# Altium project STM8_DevBoard.PrjPCB
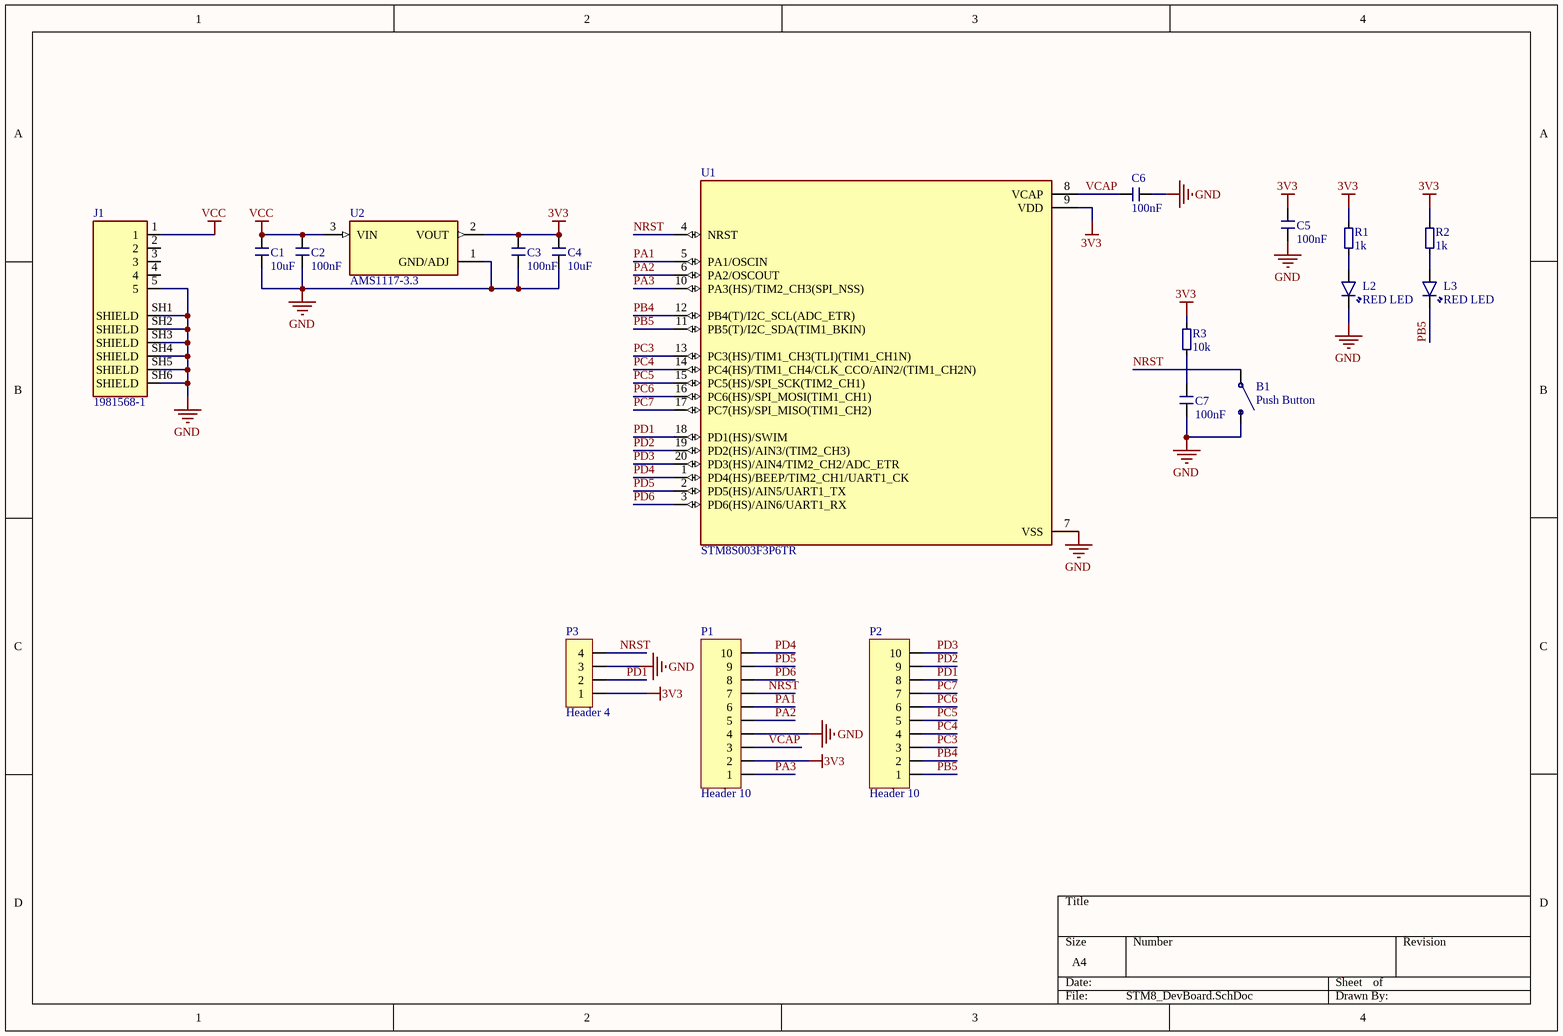
[diagram p0: STM8_DevBoard.SchDoc]
1 sheet, 19 parts. Net scope: global (net labels, ports and power ports of the same name join across sheets).
Board file: STM8_DevBoard.PcbDoc

## Sheet STM8_DevBoard.SchDoc
size A4

### Parts
B1  Push Button  [NRST]
C1  10uF  [1206_Capacitor]
C2  100nF  [1206_Capacitor]
C3  100nF  [1206_Capacitor]
C4  10uF  [1206_Capacitor]
C5  100nF  [1206_Capacitor]
C6  100nF  [1206_Capacitor]
C7  100nF  [1206_Capacitor]
J1  1981568-1  [TE_1981568-1]
L2  RED LED  [0805_LED]
L3  RED LED  [0805_LED]
P1  Header 10  [Header 10]
P2  Header 10  [Header 10]
P3  Header 4  [Header 4]
R1  1k  [1206 Resistor]
R2  1k  [1206 Resistor]
R3  10k  [1206 Resistor]
U1  STM8S003F3P6TR  [SOP65P640X120-20N]
U2  AMS1117-3.3  [SOT229P700X180-4N]

### Nets
3V3: C3.2 C4.1 C5.2 P1.2 P3.1 R1.2 R2.2 R3.2 U1.9(VDD) U2.2(VOUT)
GND: B1.2 C1.1 C2.1 C3.1 C4.2 C5.1 C6.2 C7.1 J1.5 J1.SH1(SHIELD) J1.SH2(SHIELD) J1.SH3(SHIELD) J1.SH4(SHIELD) J1.SH5(SHIELD) J1.SH6(SHIELD) L2.L_2 P1.4 P3.3 U1.7(VSS) U2.1(GND/ADJ)
VCC: C1.2 C2.2 J1.1 U2.3(VIN)
NRST: B1.1 P1.7 P3.4 U1.4(NRST)
PA1: P1.6 U1.5(PA1/OSCIN)
PA2: P1.5 U1.6(PA2/OSCOUT)
PA3: P1.1 U1.10(PA3(HS)/TIM2_CH3(SPI_NSS))
PB4: P2.2 U1.12(PB4(T)/I2C_SCL(ADC_ETR))
PB5: L3.L_2 P2.1 U1.11(PB5(T)/I2C_SDA(TIM1_BKIN))
PC3: P2.3 U1.13(PC3(HS)/TIM1_CH3(TLI)(TIM1_CH1N))
PC4: P2.4 U1.14(PC4(HS)/TIM1_CH4/CLK_CCO/AIN2/(TIM1_CH2N))
PC5: P2.5 U1.15(PC5(HS)/SPI_SCK(TIM2_CH1))
PC6: P2.6 U1.16(PC6(HS)/SPI_MOSI(TIM1_CH1))
PC7: P2.7 U1.17(PC7(HS)/SPI_MISO(TIM1_CH2))
PD1: P2.8 P3.2 U1.18(PD1(HS)/SWIM)
PD2: P2.9 U1.19(PD2(HS)/AIN3/(TIM2_CH3))
PD3: P2.10 U1.20(PD3(HS)/AIN4/TIM2_CH2/ADC_ETR)
PD4: P1.10 U1.1(PD4(HS)/BEEP/TIM2_CH1/UART1_CK)
PD5: P1.9 U1.2(PD5(HS)/AIN5/UART1_TX)
PD6: P1.8 U1.3(PD6(HS)/AIN6/UART1_RX)
VCAP: C6.1 P1.3 U1.8(VCAP)
NetC7_2: C7.2 R3.1
NetL2_L_1: L2.L_1 R1.1
NetL3_L_1: L3.L_1 R2.1

Not connected (* = marked no-connect by the designer): J1 2 3 4

### Library data of the parts
C1-C7 = 1206_Capacitor
L2 L3 = 0805_LED
R1-R3 = 1206 Resistor
U1 = STM8S003F3P6TR: STM8 STM8S Microcontroller IC 8-Bit 16MHz 8KB (8K x 8) FLASH 20-TSSOP; MF: STMicroelectronics; Purchase-URL: https://pricing.snapeda.com/search/part/STM8S003F3P6TR/?ref=eda; Value: *; SnapEDA_Link: https://www.snapeda.com/parts/STM8S003F3P6TR/STMicroelectronics/view-part/214129/?ref=snap; Package: TSSOP-20 STMicroelectronics; Availability: Good; Price: None; MP: STM8S003F3P6TR
U2 = AMS1117-3.3: Sot223/Pkg 1-Amp 3.3-Volt Low Drop Out Voltage Regulatator; MF: Advanced Monolithic Systems; Package: SOT-223 Seeed Technology; Value: *; Check_prices: https://www.snapeda.com/parts/AMS1117-3.3/Advanced+Monolithic+Systems/view-part/?ref=eda; Price: None; Availability: Not in stock; MP: AMS1117-3.3; SnapEDA_Link: https://www.snapeda.com/parts/AMS1117-3.3/Advanced+Monolithic+Systems/view-part/?ref=snap
J1 = 1981568-1: Package: None; Price: None; Value: *; MP: 1981568-1; Availability: Unavailable